# EAGLE design untitled2222 (EAGLE 5.08)
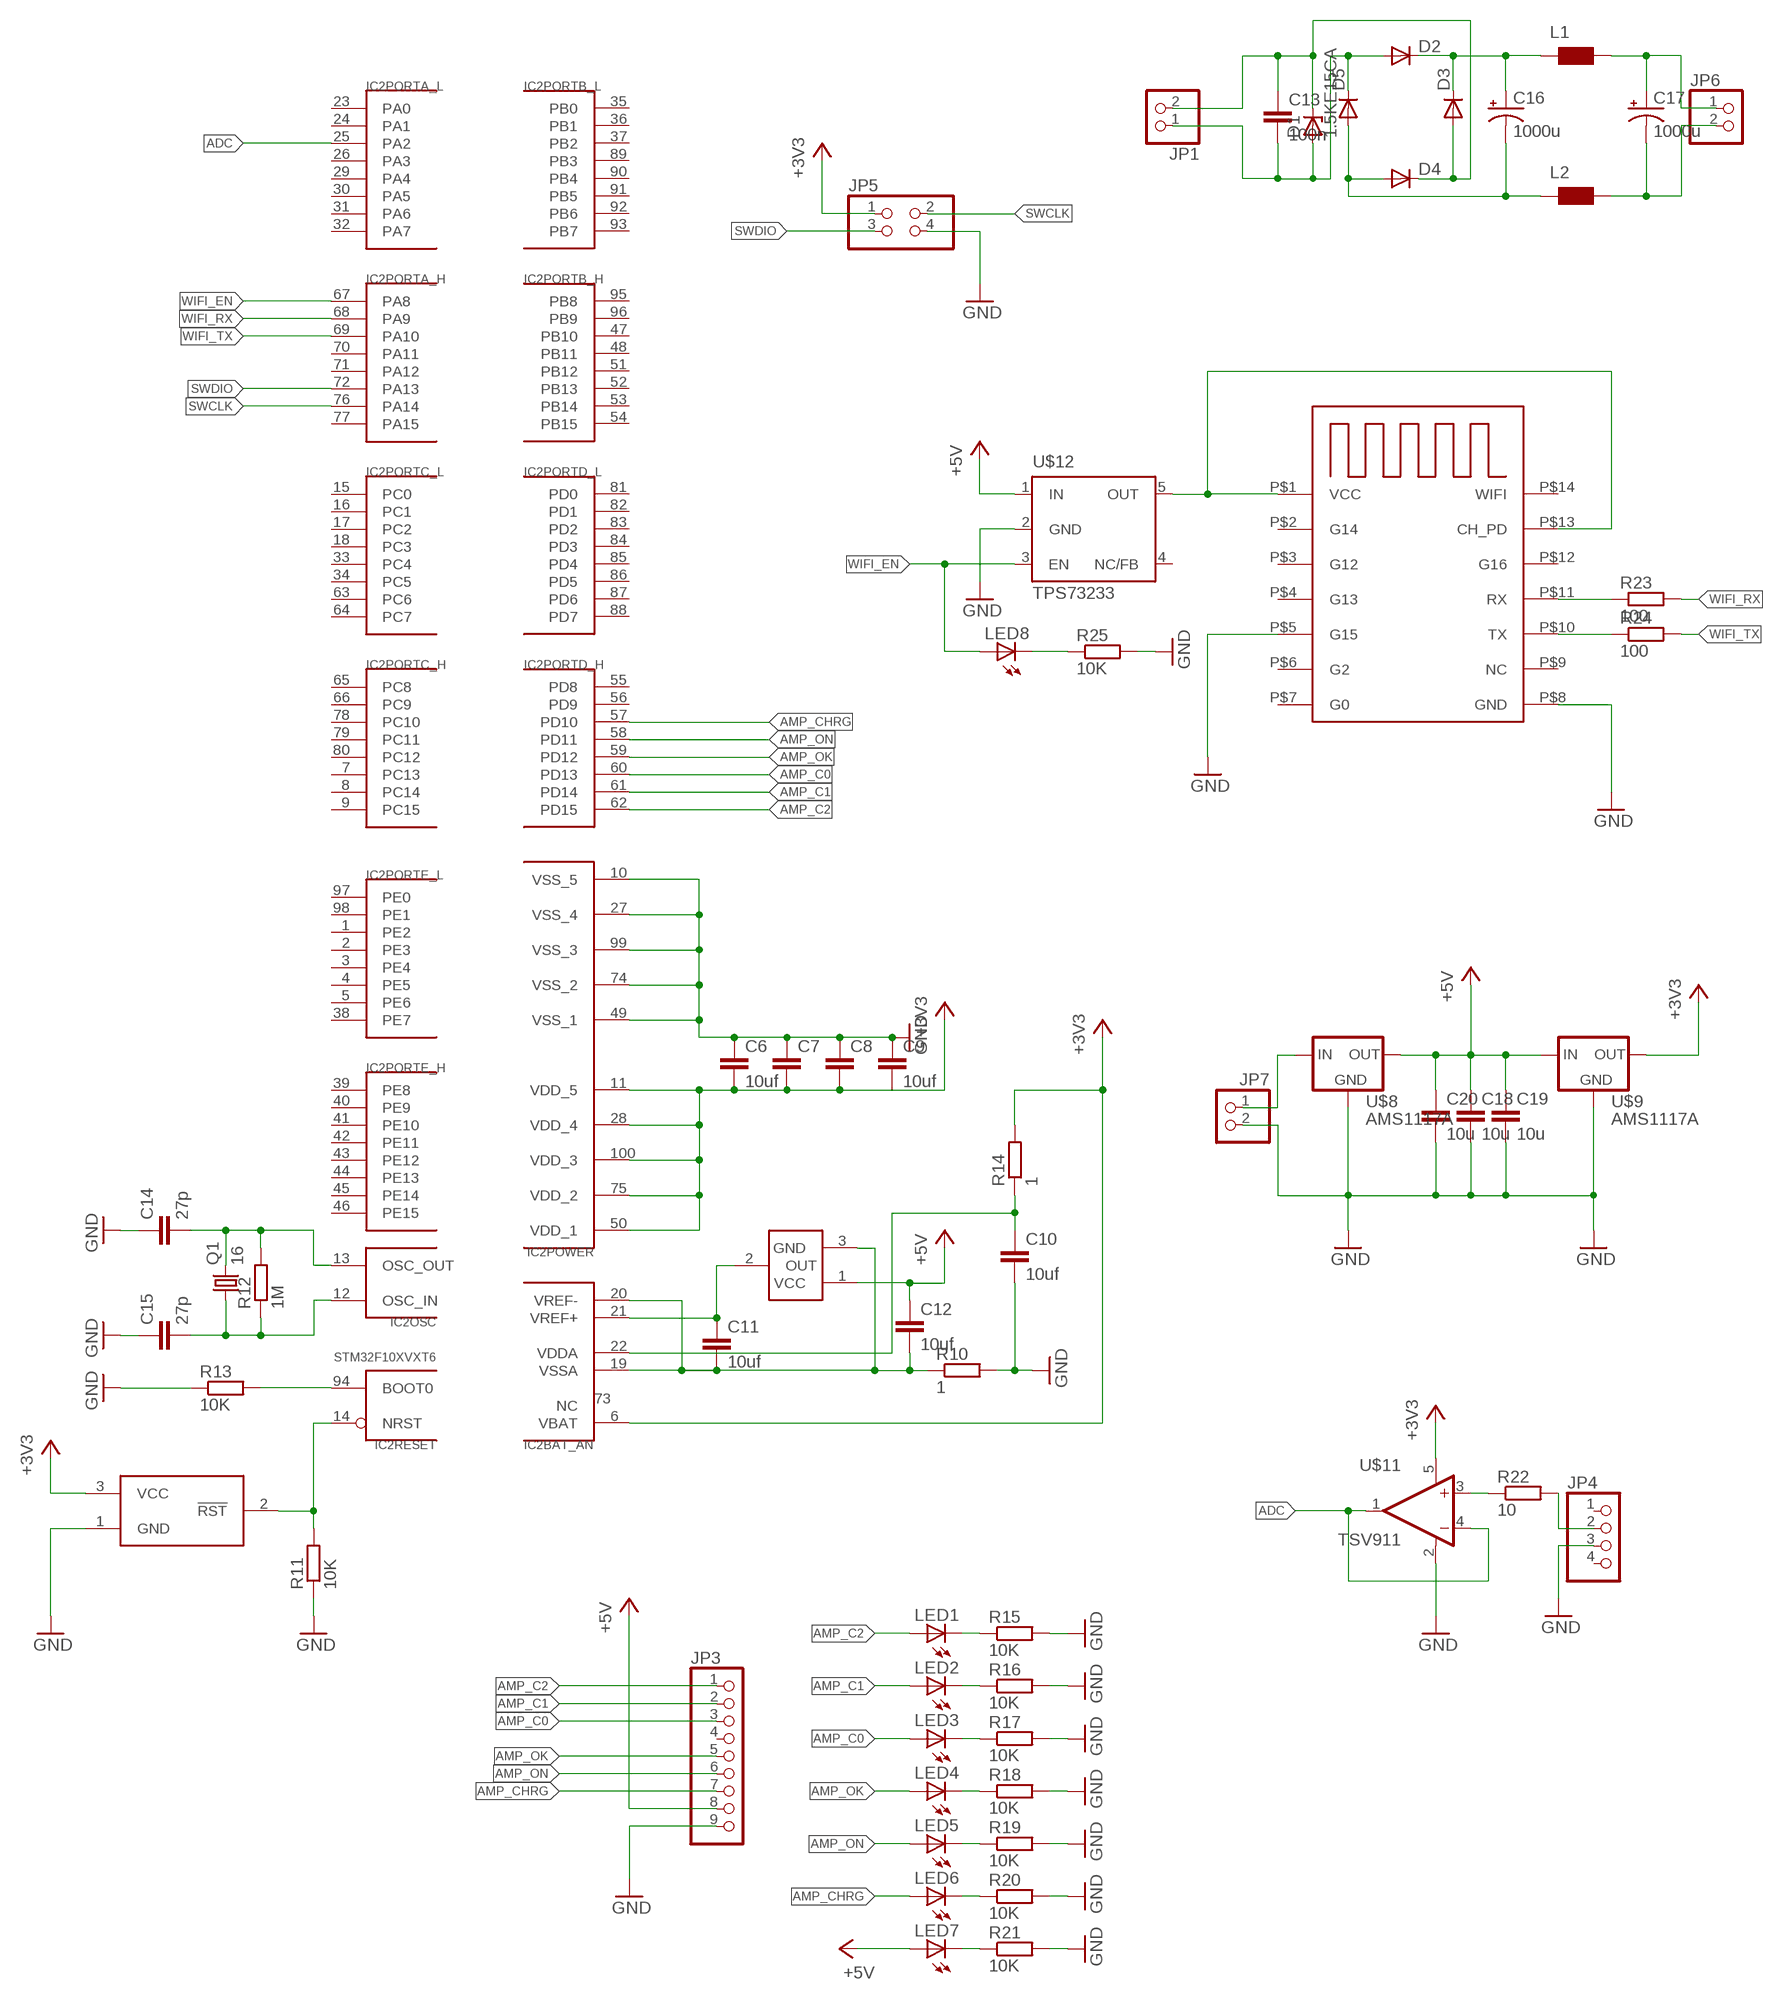
[diagram p0: schematic, sheet 1]

## Parts
C6  10uf  C-EUC0603  [C0603]
C7  C-EUC0603  [C0603]
C8  C-EUC0603  [C0603]
C9  10uf  C-EUC0603  [C0603]
C10  10uf  C-EUC0603  [C0603]
C11  10uf  C-EUC0603  [C0603]
C12  10uf  C-EUC0805  [C0805]
C13  100n  C-EUC0603  [C0603]
C14  27p  C-EUC0603  [C0603]
C15  27p  C-EUC0603  [C0603]
C16  1000u  CPOL-USE5-8.5  [E5-8,5]
C17  1000u  CPOL-USE5-8.5  [E5-8,5]
C18  10u  C-EUC0603  [C0603]
C19  10u  C-EUC0805  [C0805]
C20  10u  C-EUC0805  [C0805]
D1  1.5KE15CA  ZENER-DIODEZD-12.5  [ZDIO12.5]
D2  DIODE-SMB  [SMB]
D3  DIODE-SMB  [SMB]
D4  DIODE-SMB  [SMB]
D5  DIODE-SMB  [SMB]
IC2  STM32F10XVXT6  [TQFP100]
JP1  PINHD-1X2  [1X02]
JP3  PINHD-1X09_2.54-S  [1X09-S]
JP4  PINHD-1X04_2.54-S  [1X04-S]
JP5  PINHD-2X02_2.54-SMD  [2X02SMD]
JP6  PINHD-1X2  [1X02]
JP7  PINHD-1X02_2.54  [1X02]
L1  WE-ASI_L  [WE-ASI_L]
L2  WE-ASI_L  [WE-ASI_L]
LED1  LEDCHIPLED_0805  [CHIPLED_0805]
LED2  LEDCHIPLED_0805  [CHIPLED_0805]
LED3  LEDCHIPLED_0805  [CHIPLED_0805]
LED4  LEDCHIPLED_0805  [CHIPLED_0805]
LED5  LEDCHIPLED_0805  [CHIPLED_0805]
LED6  LEDCHIPLED_0805  [CHIPLED_0805]
LED7  LEDCHIPLED_0805  [CHIPLED_0805]
LED8  LEDCHIPLED_0805  [CHIPLED_0805]
Q1  16  CRYSTALHC49UP  [HC49UP]
R10  1  R-EU_R0603  [R0603]
R11  10K  R-EU_R0603  [R0603]
R12  1M  R-EU_R0603  [R0603]
R13  10K  R-EU_R0603  [R0603]
R14  1  R-EU_R0603  [R0603]
R15  10K  R-EU_R0603  [R0603]
R16  10K  R-EU_R0603  [R0603]
R17  10K  R-EU_R0603  [R0603]
R18  10K  R-EU_R0603  [R0603]
R19  10K  R-EU_R0603  [R0603]
R20  10K  R-EU_R0603  [R0603]
R21  10K  R-EU_R0603  [R0603]
R22  10  R-EU_R0603  [R0603]
R23  100  R-EU_R0603  [R0603]
R24  100  R-EU_R0603  [R0603]
R25  10K  R-EU_R0603  [R0603]
U$6  REF3025  [SOT23]
U$7  ESP03  [ESP03]
U$8  AMS1117A  [DPACK]
U$9  AMS1117A  [DPACK]
U$10  LM809  [SOT23]
U$11  TSV911  [SOT23-5L]
U$12  TPS73233  [SOT23-DBV]

## Nets
+3V3: C6.2 C7.2 C8.2 C9.2 IC2.6(BAT_AN:VBAT) IC2.11(POWER:VDD_5) IC2.28(POWER:VDD_4) IC2.50(POWER:VDD_1) IC2.75(POWER:VDD_2) IC2.100(POWER:VDD_3) JP5.1 R14.2 U$9.2(OUT) U$10.3(VCC) U$11.5(V+)
+5V: C12.1 C18.1 C19.1 C20.1 JP3.8 LED7.A U$6.1(VCC) U$8.2(OUT) U$9.3(IN) U$12.1(IN)
ADC: IC2.25(PORTA_L:PA2) U$11.1(OUT) U$11.4(-IN)
AMP_C0: IC2.60(PORTD_H:PD13) JP3.3 LED3.A
AMP_C1: IC2.61(PORTD_H:PD14) JP3.2 LED2.A
AMP_C2: IC2.62(PORTD_H:PD15) JP3.1 LED1.A
AMP_CHRG: IC2.57(PORTD_H:PD10) JP3.7 LED6.A
AMP_OK: IC2.59(PORTD_H:PD12) JP3.5 LED4.A
AMP_ON: IC2.58(PORTD_H:PD11) JP3.6 LED5.A
GND: C6.1 C7.1 C8.1 C9.1 C10.2 C14.1 C15.1 C18.2 C19.2 C20.2 IC2.10(POWER:VSS_5) IC2.27(POWER:VSS_4) IC2.49(POWER:VSS_1) IC2.74(POWER:VSS_2) IC2.99(POWER:VSS_3) JP3.9 JP4.3 JP5.4 JP7.2 R10.2 R11.1 R13.1 R15.2 R16.2 R17.2 R18.2 R19.2 R20.2 R21.2 R25.2 U$7.P$5(G15) U$7.P$8(GND) U$8.1(GND) U$9.1(GND) U$10.1(GND) U$11.2(V-) U$12.2(GND)
N$12: C13.2 D1.A D2.A D5.C JP1.1
N$13: C17.+ JP6.1 L1.1
N$14: C11.1 IC2.21(BAT_AN:VREF+) U$6.2(OUT)
N$15: C10.1 IC2.22(BAT_AN:VDDA) R14.1
N$16: C11.2 C12.2 IC2.19(BAT_AN:VSSA) IC2.20(BAT_AN:VREF-) R10.1 U$6.3(GND)
N$17: IC2.14(RESET:NRST) R11.2 U$10.2(!RST)
N$18: C16.+ D2.C D3.C L1.2
N$19: C16.- D4.A D5.A L2.2
N$20: C14.2 IC2.13(OSC:OSC_OUT) Q1.2 R12.2
N$21: C15.2 IC2.12(OSC:OSC_IN) Q1.1 R12.1
N$22: IC2.94(RESET:BOOT0) R13.2
N$23: C13.1 D1.C D3.A D4.C JP1.2
N$24: U$7.P$1(VCC) U$7.P$13(CH_PD) U$12.5(OUT)
N$25: LED8.C R25.1
N$28: R22.1 U$11.3(+IN)
N$29: LED7.C R21.1
N$30: JP7.1 U$8.3(IN)
N$32: JP4.2 R22.2
N$35: LED1.C R15.1
N$36: LED2.C R16.1
N$37: LED3.C R17.1
N$38: LED4.C R18.1
N$39: LED5.C R19.1
N$40: LED6.C R20.1
PW_GND: C17.- JP6.2 L2.1
SWCLK: IC2.76(PORTA_H:PA14) JP5.2
SWDIO: IC2.72(PORTA_H:PA13) JP5.3
WIFI_EN: IC2.67(PORTA_H:PA8) LED8.A U$12.3(EN)
WIFI_RX: IC2.68(PORTA_H:PA9) R23.2
WIFI_RX1: R23.1 U$7.P$11(RX)
WIFI_TX: IC2.69(PORTA_H:PA10) R24.2
WIFI_TX1: R24.1 U$7.P$10(TX)
Unconnected: IC2.1(PORTE_L:PE2) IC2.2(PORTE_L:PE3) IC2.3(PORTE_L:PE4) IC2.4(PORTE_L:PE5) IC2.5(PORTE_L:PE6) IC2.7(PORTC_H:PC13) IC2.8(PORTC_H:PC14) IC2.9(PORTC_H:PC15) IC2.15(PORTC_L:PC0) IC2.16(PORTC_L:PC1) IC2.17(PORTC_L:PC2) IC2.18(PORTC_L:PC3) IC2.23(PORTA_L:PA0) IC2.24(PORTA_L:PA1) IC2.26(PORTA_L:PA3) IC2.29(PORTA_L:PA4) IC2.30(PORTA_L:PA5) IC2.31(PORTA_L:PA6) IC2.32(PORTA_L:PA7) IC2.33(PORTC_L:PC4) IC2.34(PORTC_L:PC5) IC2.35(PORTB_L:PB0) IC2.36(PORTB_L:PB1) IC2.37(PORTB_L:PB2) IC2.38(PORTE_L:PE7) IC2.39(PORTE_H:PE8) IC2.40(PORTE_H:PE9) IC2.41(PORTE_H:PE10) IC2.42(PORTE_H:PE11) IC2.43(PORTE_H:PE12) IC2.44(PORTE_H:PE13) IC2.45(PORTE_H:PE14) IC2.46(PORTE_H:PE15) IC2.47(PORTB_H:PB10) IC2.48(PORTB_H:PB11) IC2.51(PORTB_H:PB12) IC2.52(PORTB_H:PB13) IC2.53(PORTB_H:PB14) IC2.54(PORTB_H:PB15) IC2.55(PORTD_H:PD8) IC2.56(PORTD_H:PD9) IC2.63(PORTC_L:PC6) IC2.64(PORTC_L:PC7) IC2.65(PORTC_H:PC8) IC2.66(PORTC_H:PC9) IC2.70(PORTA_H:PA11) IC2.71(PORTA_H:PA12) IC2.73(BAT_AN:NC) IC2.77(PORTA_H:PA15) IC2.78(PORTC_H:PC10) IC2.79(PORTC_H:PC11) IC2.80(PORTC_H:PC12) IC2.81(PORTD_L:PD0) IC2.82(PORTD_L:PD1) IC2.83(PORTD_L:PD2) IC2.84(PORTD_L:PD3) IC2.85(PORTD_L:PD4) IC2.86(PORTD_L:PD5) IC2.87(PORTD_L:PD6) IC2.88(PORTD_L:PD7) IC2.89(PORTB_L:PB3) IC2.90(PORTB_L:PB4) IC2.91(PORTB_L:PB5) IC2.92(PORTB_L:PB6) IC2.93(PORTB_L:PB7) IC2.95(PORTB_H:PB8) IC2.96(PORTB_H:PB9) IC2.97(PORTE_L:PE0) IC2.98(PORTE_L:PE1) JP3.4 JP4.1 JP4.4 U$7.P$2(G14) U$7.P$3(G12) U$7.P$4(G13) U$7.P$6(G2) U$7.P$7(G0) U$7.P$9(NC) U$7.P$12(G16) U$7.P$14(WIFI) U$12.4(NC/FB)

## Library data of the parts
C6-C15 C18-C20 = rcl:C-EU: CAPACITOR, European symbol
C16 C17 = rcl:CPOL-US: POLARIZED CAPACITOR, American symbol
D1 = diode:ZENER-DIODE: Z-Diode
D2-D5 = diode:DIODE-: DIODE
IC2 = stm32:STM32F10XVXT6: STM32F101/103 100 pin LQFP
JP1 JP6 = pinhead:PINHD-1X2: PIN HEADER
JP3 = pinhead-2:PINHD-1X09: PIN HEADER
JP4 = pinhead-2:PINHD-1X04: PIN HEADER
JP5 = pinhead-2:PINHD-2X02: PIN HEADER
JP7 = pinhead-2:PINHD-1X02: PIN HEADER
L1 L2 = wuerth-elektronik:WE-ASI: SMD-Wire Wound Inductor WE-ASI Especially designed for Automation Standard Interface applications - Specially constructed for sensors and actuators
LED1-LED8 = led:LED: LED OSRAM: - CHIPLED LG R971, LG N971, LY N971, LG Q971, LY Q971, LO R971, LY R971 LH N974, LH R974 LS Q976, LO Q976, LY Q976 LO Q996 - Hyper CHIPLED LW Q18S LB Q993, LB Q99A, LB R99A - SideLED LS A670, LO A670, LY A670, LG A670, LP A670 LB A673, LV A673, LT A673, LW A673 LH A674 LY A675 LS A676, LA A676, LO A676, LY A676, LW A676 LS A679, LY A679, LG A679 - Hyper Micro SIDELED® LS Y876, LA Y876, LO Y876, LY Y876 LT Y87S - SmartLED LW L88C, LW L88S LB L89C, LB L89S, LG L890 LS L89K, LO L89K, LY L89K LS L896, LA L896, LO L896, LY L896 - TOPLED LS T670, LO T670, LY T670, LG T670, LP T670 LSG T670, LSP T670, LSY T670, LOP T670, LYG T670 LG T671, LOG T671, LSG T671 LB T673, LV T673, LT T673, LW T673 LH T674 LS T676, LA T676, LO T676, LY T676, LB T676, LH T676, LSB T676, LW T676 LB T67C, LV T67C, LT T67C, LS T67K, LO T67K, LY T67K, LW E67C LS E67B, LA E67B, LO E67B, LY E67B, LB E67C, LV E67C, LT E67C LW T67C LS T679, LY T679, LG T679 LS T770, LO T770, LY T770, LG T770, LP T770 LB T773, LV T773, LT T773, LW T773 LH T774 LS E675, LA E675, LY E675, LS T675 LS T776, LA T776, LO T776, LY T776, LB T776 LHGB T686 LT T68C, LB T68C - Hyper Mini TOPLED® LB M676 - Mini TOPLED Santana® LG M470 LS M47K, LO M47K, LY M47K Source: http://www.osram.convergy.de LUXEON: - LUMILED® LXK2-PW12-R00, LXK2-PW12-S00, LXK2-PW14-U00, LXK2-PW14-V00 LXK2-PM12-R00, LXK2-PM12-S00, LXK2-PM14-U00 LXK2-PE12-Q00, LXK2-PE12-R00, LXK2-PE12-S00, LXK2-PE14-T00, LXK2-PE14-U00 LXK2-PB12-K00, LXK2-PB12-L00, LXK2-PB12-M00, LXK2-PB14-N00, LXK2-PB14-P00, LXK2-PB14-Q00 LXK2-PR12-L00, LXK2-PR12-M00, LXK2-PR14-Q00, LXK2-PR14-R00 LXK2-PD12-Q00, LXK2-PD12-R00, LXK2-PD12-S00 LXK2-PH12-R00, LXK2-PH12-S00 LXK2-PL12-P00, LXK2-PL12-Q00, LXK2-PL12-R00 Source: www.luxeon.com KINGBRIGHT: KA-3528ASYC Source: www.kingbright.com
Q1 = crystal:CRYSTAL: CRYSTAL
R10-R25 = resistor:R-EU_: RESISTOR, European symbol
U$6 = ADC:REF3025
U$7 = connectors:ESP03
U$8 U$9 = stabil:AMS1117A
U$10 = ARM:LM809
U$11 = OU:TSV911
U$12 = stabil:TPS73233

## Board
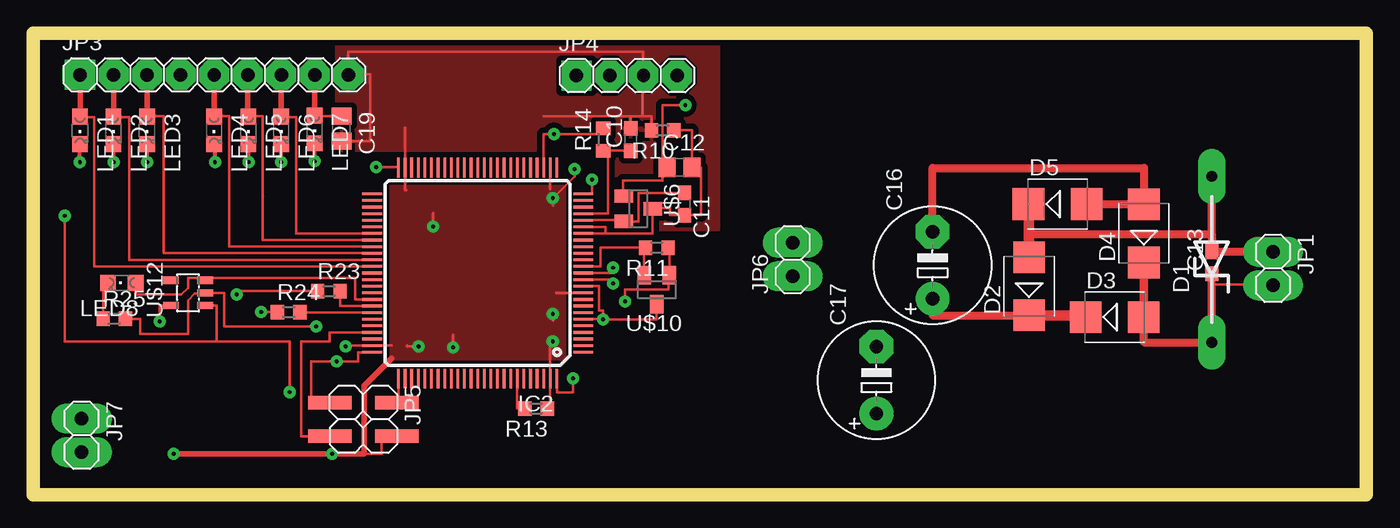
[diagram p1: board, top side]
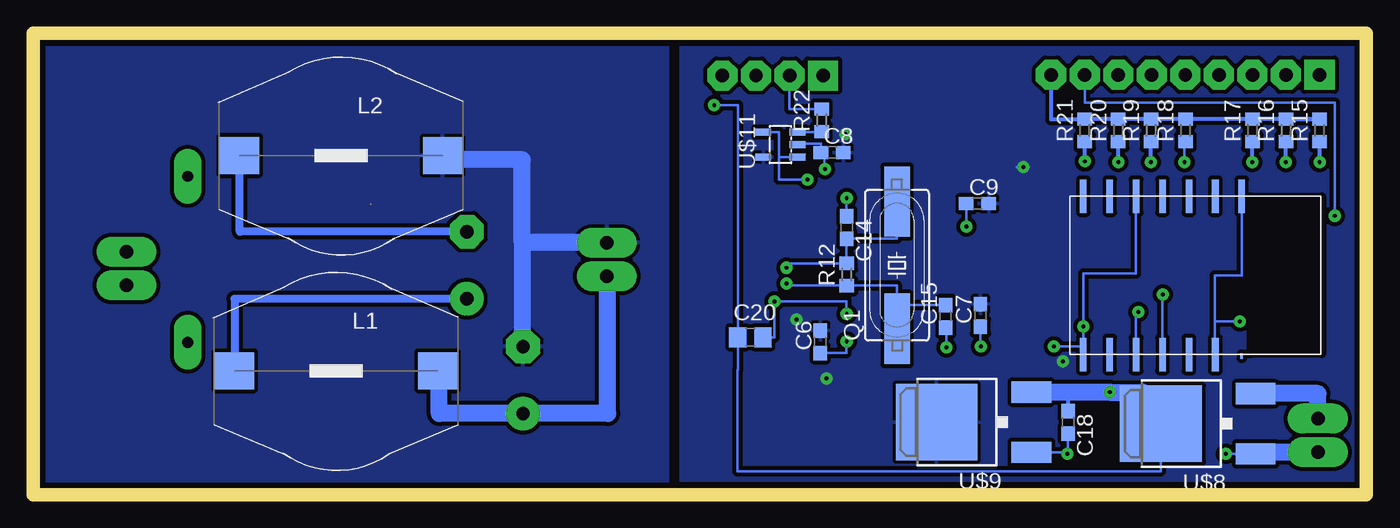
[diagram p2: board, bottom side, seen from below]

Size 101 x 35 mm. Coordinates in mm from the lower left corner, seen from the top.
Outline: 0,0 101,0 101,35 0,35 0,0
Copper layers (1*16): Top 0.015mm / dielectric 1.5mm / Bottom 0.015mm
Design rules "default *": minimum track width 0.2mm, minimum drill 0.3mm, track to track 0.25mm, track to pad 0.25mm, pad to pad 0.25mm, via to via 0.25mm, smd to smd 0.25mm, copper to edge 0.4mm, drill to drill 0.4mm, minimum pad ring 25mil, minimum via ring 12mil, stop-mask expansion 4mil, vias tented up to drill 0mil, thermal gap 10mil
bRestrict: area 3.4,10.7 to 8.8,22.6

### Footprints (pad centres in the part's own frame; a part is rotated, then mirrored left to right if it is on the bottom)
C0603 = smd 1.1 x 1: 1 -0.85,0; 2 0.85,0
C0805 = smd 1.3 x 1.5: 1 -0.95,0; 2 0.95,0
E5-8,5 = drill 1.016 pad 2.54 round: + -2.54,0 | drill 1.016 pad 2.54 octagon: - 2.54,0
ZDIO12.5 = drill 0.813 long: A 6.223,0; C -6.35,0
SMB = smd 2.4 x 2.4: A 2.2,0; C -2.2,0
TQFP100 = smd 1.5 x 0.2: 1 -8,6; 2 -8,5.5; 3 -8,5; 4 -8,4.5; 5 -8,4; 6 -8,3.5; 7 -8,3; 8 -8,2.5; 9 -8,2; 10 -8,1.5; 11 -8,1; 12 -8,0.5; 13 -8,0; 14 -8,-0.5; 15 -8,-1; 16 -8,-1.5; 17 -8,-2; 18 -8,-2.5; 19 -8,-3; 20 -8,-3.5; 21 -8,-4; 22 -8,-4.5; 23 -8,-5; 24 -8,-5.5; 25 -8,-6; 51 8,-6; 52 8,-5.5; 53 8,-5; 54 8,-4.5; 55 8,-4; 56 8,-3.5; 57 8,-3; 58 8,-2.5; 59 8,-2; 60 8,-1.5; 61 8,-1; 62 8,-0.5; 63 8,0; 64 8,0.5; 65 8,1; 66 8,1.5; 67 8,2; 68 8,2.5; 69 8,3; 70 8,3.5; 71 8,4; 72 8,4.5; 73 8,5; 74 8,5.5; 75 8,6 | smd 0.2 x 1.5: 26 -6,-8; 27 -5.5,-8; 28 -5,-8; 29 -4.5,-8; 30 -4,-8; 31 -3.5,-8; 32 -3,-8; 33 -2.5,-8; 34 -2,-8; 35 -1.5,-8; 36 -1,-8; 37 -0.5,-8; 38 0,-8; 39 0.5,-8; 40 1,-8; 41 1.5,-8; 42 2,-8; 43 2.5,-8; 44 3,-8; 45 3.5,-8; 46 4,-8; 47 4.5,-8; 48 5,-8; 49 5.5,-8; 50 6,-8; 76 6,8; 77 5.5,8; 78 5,8; 79 4.5,8; 80 4,8; 81 3.5,8; 82 3,8; 83 2.5,8; 84 2,8; 85 1.5,8; 86 1,8; 87 0.5,8; 88 0,8; 89 -0.5,8; 90 -1,8; 91 -1.5,8; 92 -2,8; 93 -2.5,8; 94 -3,8; 95 -3.5,8; 96 -4,8; 97 -4.5,8; 98 -5,8; 99 -5.5,8; 100 -6,8
1X02 = drill 1.016 long: 1 -1.27,0; 2 1.27,0
1X09-S = drill 1.016 square: 1 -10.16,0 | drill 1.016 octagon: 2 -7.62,0; 3 -5.08,0; 4 -2.54,0; 5 0,0; 6 2.54,0; 7 5.08,0; 8 7.62,0; 9 10.16,0
1X04-S = drill 1.016 square: 1 -3.81,0 | drill 1.016 octagon: 2 -1.27,0; 3 1.27,0; 4 3.81,0
2X02SMD = smd 1.016 x 3.302: 1 -1.27,-3.81; 2 -1.27,1.27; 3 1.27,-3.81; 4 1.27,1.27
WE-ASI_L = smd 2.92 x 2.79: 1 -7.685,0; 2 7.685,0
CHIPLED_0805 = smd 1.2 x 1.2: A 0,-1.05; C 0,1.05
HC49UP = smd 5.334 x 1.93: 1 -4.826,0; 2 4.826,0
R0603 = smd 1 x 1.1: 1 -0.85,0; 2 0.85,0
SOT23 = smd 1 x 1.4: 1 -0.95,-1.1; 2 0.95,-1.1; 3 0,1.1
ESP03 = smd 2.54 x 0.5: P$1 0,0; P$2 0,-2; P$3 0,-4; P$4 0,-6; P$5 0,-8; P$6 0,-10; P$7 0,-12; P$8 12,-12; P$9 12,-10; P$10 12,-8; P$11 12,-6; P$12 12,-4; P$13 12,-2 | smd 0.406 x 0.203: P$14 12.13,0
DPACK = smd 1.6 x 3: 1 -2.28,-4.8; 3 2.28,-4.8 | smd 5.8 x 6.2: 2 0,2.38
SOT23-5L = smd 0.55 x 1.2: 1 -0.95,-1.3; 2 0,-1.3; 3 0.95,-1.3; 4 0.95,1.3; 5 -0.95,1.3
SOT23-DBV = smd 0.55 x 1.2: 1 -0.95,-1.3; 2 0,-1.3; 3 0.95,-1.3; 4 0.95,1.3; 5 -0.95,1.3

### Placement (x,y rotation side)
C6  41.37,11.59 90 bottom
C7  29.24,13.6 90 bottom
C8  40.47,25.94 0 bottom
C9  29.46,22.06 0 bottom
C10  45.28,26.92 90 top
C11  49.34,22.03 270 top
C12  48.97,24.81 0 top
C13  89.28,17.59 90 top
C14  39.37,20.26 270 bottom
C15  31.88,13.53 90 bottom
C16  68.14,17.4 90 top
C17  63.88,8.7 90 top
C18  22.61,5.5 270 bottom
C19  23.37,27.75 270 top
C20  46.67,11.94 0 bottom
D1  89.28,17.91 90 top
D2  75.44,15.81 90 top
D3  81.92,13.46 0 top
D4  84.14,19.81 90 top
D5  77.6,22.03 0 top
IC2  33.68,16.81 180 top
JP1  93.92,17.14 270 top
JP3  13.72,31.84 0 top
JP4  44.97,31.77 0 top
JP5  26.29,5.71 270 top
JP6  57.53,17.84 90 top
JP7  3.68,4.51 270 top
L1  78.04,9.4 180 bottom
L2  77.66,25.72 180 bottom
LED1  3.56,27.62 180 top
LED2  6.1,27.62 180 top
LED3  8.64,27.62 180 top
LED4  13.72,27.62 180 top
LED5  16.32,27.62 180 top
LED6  18.8,27.62 180 top
LED7  21.34,27.69 180 top
LED8  6.73,16.07 90 top
Q1  35.56,17.4 90 bottom
R10  47.69,27.62 180 top
R11  47.24,18.73 180 top
R12  39.37,16.7 90 bottom
R13  38.1,6.54 180 top
R14  43.18,26.92 90 top
R15  3.56,27.62 90 bottom
R16  6.1,27.62 90 bottom
R17  8.64,27.62 90 bottom
R18  13.72,27.62 90 bottom
R19  16.32,27.62 90 bottom
R20  18.8,27.62 90 bottom
R21  21.34,27.62 90 bottom
R22  41.27,28.38 90 bottom
R23  22.42,15.43 0 top
R24  19.37,13.84 0 top
R25  6.16,13.34 0 top
U$6  45.83,21.68 270 top
U$7  9.45,22.64 270 bottom
U$8  13.19,5.39 90 bottom
U$9  30.18,5.5 90 bottom
U$10  47.24,15.56 180 top
U$11  44.39,26.54 90 bottom
U$12  11.75,15.3 90 top

### Tracks (layer width: path | path; a pad name or v marks a point on that pad's centre or on a via)
+3V3  (via drill 0.3)
  Top 0.2: IC2.6 v43.18,13.31 v43.18,13.3 | 39.43,27.34 39.43,27.37 | R14.2 43.18,27.34 v39.47,27.34 39.43,27.34 | U$10.3 47.24,13.3 v43.18,13.3 | IC2.50 27.68,24.83 v25.97,24.83 | IC2.28 38.68,27.34 39.43,27.34 | JP5.1 21.08,6.99 21.08,10.1 v22.99,10.1 24.64,10.1 24.64,10.79 25.68,10.79 IC2.75 | v40.89,8.83 40.89,7.75 39.68,7.75 IC2.100 | IC2.11 42.86,15.81 42.86,13.97 43.18,13.97 v43.18,13.3
  Bottom 0.2: v25.97,24.83 26.48,24.83 | v40.89,8.83 40.58,8.83
  pour Bottom (isolate 0.305): 0.96,34.06 51.96,34.06 51.96,1.06 0.96,1.06
+5V  (via drill 0.3)
  Top 0.2: U$6.1 44.7,22.63 44.7,23.81 47.69,23.81 47.69,24.81 | U$12.1 13.91,14.35 13.91,11.62 | 47.69,24.81 47.69,29.53 v49.4,29.53 | C19.1 21.34,28.7 LED7.A | 47.69,24.81 C12.1 | 13.91,11.62 19.43,11.62 v19.43,7.78 | 13.91,11.62 2.41,11.62 v2.41,21.14
  Top 0.406: JP3.8 LED7.A
  Bottom 0.2: U$9.3 23.11,7.78 | v2.41,21.14 2.41,29.72 21.34,29.72 JP3.8 | 16.97,7.78 15.57,7.78 U$8.2 15.57,1.78 47.64,1.78 47.64,9.46 47.62,9.46 C20.1 47.62,29.53 v49.4,29.53
  Bottom 0.305: 22.61,7.78 C18.1
  Bottom 1.27: 16.97,7.78 v19.43,7.78 22.61,7.78 U$9.3
ADC  (via drill 0.3)  (1 unrouted)
  Top 0.2: v42.35,23.88 42.35,22.8 41.68,22.8 IC2.25
  Bottom 0.2: U$11.4 44.51,27.5 44.51,25.59 | 44.51,25.59 U$11.1 | v42.35,23.88 44.51,23.88 44.51,25.59
AMP_C0
  Top 0.2: IC2.60 9.91,18.31 9.91,28.7 8.64,28.7 LED3.A
  Top 0.406: LED3.A JP3.3
AMP_C1
  Top 0.2: IC2.61 7.3,17.81 7.3,28.64 6.1,28.64 LED2.A
  Top 0.406: JP3.2 LED2.A
AMP_C2
  Top 0.2: IC2.62 4.64,17.31 4.64,28.64 3.56,28.64 LED1.A
  Top 0.406: LED1.A JP3.1
AMP_CHRG
  Top 0.2: IC2.57 19.94,19.81 19.94,28.64 18.8,28.64 LED6.A
  Top 0.406: LED6.A JP3.7
AMP_OK
  Top 0.2: IC2.59 14.86,18.81 14.86,28.7 13.72,28.7 LED4.A
  Top 0.406: LED4.A JP3.5
AMP_ON
  Top 0.2: IC2.58 17.4,19.31 17.4,28.7 16.32,28.7 LED5.A
  Top 0.406: LED5.A 16.26,28.67 JP3.6
GND  (via drill 0.3)  (1 unrouted)
  Top 0.2: v31.81,11.18 31.81,12.13 | v29.21,11.24 28.32,11.24 28.32,11.3 | 39.37,21.91 v39.37,22.48 41.02,24.13 v41.02,24.7 | 46.16,28.7 45.28,28.7 | 46.16,28.7 46.84,28.7 R10.2 | 45.28,28.7 38.68,28.7 | 45.28,28.7 C10.2 | v44.83,14.67 44.83,15.56 48.13,15.56 48.13,16.66 U$10.1 48.19,18.29 48.09,18.29 R11.1 | v39.37,13.72 39.37,13.21 | 46.16,28.7 46.16,31.77 JP4.3 46.22,31.77 46.22,33.58 23.88,33.58 JP3.9 23.88,31.88 25.53,31.88 25.53,26.8 C19.2 | JP5.4 26.42,4.45 26.42,3.11 24.89,3.11 | v21.45,12.76 14.48,12.76 14.48,15.3 U$12.2 12.98,15.24 12.26,15.24 11.75,14.73 11.75,12.19 8.13,12.19 8.13,13.34 R25.2 | IC2.99 39.18,6.77 R13.1 38.95,6.82 39.18,7.05 39.18,11.62 v39.37,11.62 | IC2.10 39.62,15.3 | IC2.74 | v30.29,20.32 30.29,21.34 | 28.26,23.11 28.18,23.11 IC2.49 28.18,27.8 28.19,27.81 | IC2.27 39.18,23.18 | IC2.74 23.69,11.31 v23.69,11.24 | IC2.74 27.18,11.31 27.18,11.3
  Top 0.406: v10.67,3.11 v22.67,3.11 24.89,3.11 25.08,3.11 25.08,8.26 27.18,10.35
  Bottom 0.2: C15.1 31.81,12.68 v31.81,11.18 | 29.21,11.27 v29.21,11.24 29.24,11.24 C7.1 | C14.1 v39.37,22.48 | v39.37,13.72 39.37,14.67 v44.83,14.67 44.83,11.94 C20.2 | 17.46,22.64 17.46,16.76 21.45,16.76 v21.45,12.76 U$7.P$8 21.45,11.24 v23.69,11.24 | C9.1 30.31,20.32 v30.29,20.32 | v41.02,24.7 41.05,24.7 41.05,25.91 41.29,25.91 C8.1 41.34,25.94 41.34,26.61 43.09,26.61 U$11.2 | C6.1 39.37,10.74 v39.37,11.62 | U$9.1 22.67,3.22 v22.67,3.11 22.61,3.11 C18.2 | 8.39,3.24 U$8.1 v10.67,3.11
  Bottom 0.305: JP3.9 23.88,28.45 21.34,28.45 R21.2 R20.2 R19.2 R18.2 R17.2 R16.2 | R15.2 R16.2 | R16.2 3.43,28.47 3.43,28.57
  Bottom 1.27: JP7.2 8.39,3.24
  pour Top: 40.24,10.3 27.16,10.3 27.16,23.38 40.24,23.38
  pour Top (isolate 0.406): 22.96,34.06 22.96,26.1 43.56,26.1 43.56,20.06 51.96,20.06 51.96,34.06
N$12  (1 unrouted)
  Top 0.2: 93.92,18.44 JP1.1
  Top 0.61: 93.92,18.44 C13.2 89.28,19.75 | 89.28,19.75 D1.A | D2.A 75.44,19.75 89.28,19.75
  Top 0.813: D2.A 75.44,22.04
N$13
  Bottom 0.2: 57.59,16.57 JP6.1
  Bottom 1.27: 57.59,16.57 57.47,16.57 57.47,6.16 C17.+ 70.23,6.16 70.23,9.4 L1.1
N$14
  Top 0.2: IC2.21 44.73,20.81 U$6.2 44.73,20.7 45.85,20.7 45.85,22.88 C11.1
N$15
  Top 0.2: 43.56,26.07 C10.1 | 43.56,26.07 R14.1 | IC2.22 43.56,21.31 43.56,26.07
N$16
  Top 0.2: IC2.19 43.37,19.81 | IC2.20 43.37,20.31 43.37,19.81 | 43.37,19.81 46.93,19.81 U$6.3 46.93,21.72 48.26,21.72 48.26,21.18 C11.2 49.34,21.21 50.61,21.21 50.61,24.81 C12.2 49.92,27.62 R10.1
N$17
  Top 0.2: U$10.2 46.29,18.29 46.39,18.29 R11.2 42.99,18.73 42.99,17.31 IC2.14
N$18
  Top 0.61: C16.+ 68.14,13.61 D2.C
  Top 0.813: D3.C 79.72,13.61 D2.C
  Bottom 0.61: L1.2 85.73,14.86 C16.+
N$19
  Top 0.61: D5.A 79.8,22.01 D4.A 84.14,24.77 68.14,24.77 C16.-
  Bottom 0.61: L2.2 85.35,19.94 C16.-
N$20  (via drill 0.3)
  Top 0.2: v43.94,17.21 43.94,16.81 IC2.13
  Bottom 0.2: v43.94,17.21 43.94,17.53 39.37,17.53 R12.2 C14.2 35.56,19.41 Q1.2
N$21  (via drill 0.3)
  Top 0.2: v43.94,16 43.94,16.31 IC2.12
  Bottom 0.2: v43.94,16 43.94,15.85 R12.1 35.56,15.85 35.56,14.39 | 35.56,14.39 Q1.1 | 35.56,14.39 C15.2
N$22
  Top 0.2: R13.2 36.68,6.54 IC2.94
N$23
  Top 0.2: JP1.2 93.92,15.94 89.28,15.94 C13.1
  Top 0.61: 84.14,13.46 D4.C 84.14,11.56 D1.C C13.1
  Top 0.813: 84.14,13.46 D3.A
N$24  (via drill 0.3)
  Top 0.2: U$12.5 9.59,14.35 v9.59,13.14
  Bottom 0.2: U$7.P$1 9.46,22.64 9.46,16.64 11.49,16.64 11.49,13.14 | 11.49,13.14 11.49,10.64 U$7.P$13 | 11.49,13.14 v9.59,13.14
N$25
  Top 0.2: R25.1 5.31,16.07 LED8.C
N$28
  Bottom 0.2: R22.1 41.27,27.49 U$11.3
N$29  (via drill 0.3)
  Top 0.305: v21.34,25.27 LED7.C
  Bottom 0.305: v21.34,25.27 R21.1
N$30
  Bottom 1.27: U$8.3 3.68,7.67 JP7.1
N$32
  Bottom 0.2: 43.79,31.77 JP4.2 43.7,29.23 R22.2
N$35  (via drill 0.3)
  Top 0.305: LED1.C R15.1 v3.56,25.21
  Top 0.406: LED1.C 3.49,26.57
  Bottom 0.305: v3.56,25.21 R15.1
N$36  (via drill 0.3)
  Top 0.305: v6.1,25.21 LED2.C
  Bottom 0.305: v6.1,25.21 R16.1
N$37  (via drill 0.3)
  Top 0.305: v8.64,25.21 LED3.C
  Bottom 0.305: v8.64,25.21 R17.1
N$38  (via drill 0.3)
  Top 0.305: LED4.C 13.78,26.57 v13.78,25.21
  Bottom 0.2: R18.1 13.78,26.77 v13.78,25.21
N$39  (via drill 0.3)
  Top 0.305: v16.32,25.21 LED5.C
  Bottom 0.305: v16.32,25.21 R19.1
N$40  (via drill 0.3)
  Top 0.305: v18.8,25.21 LED6.C
  Bottom 0.305: v18.8,25.21 R20.1
PW_GND
  Bottom 0.61: 69.97,25.4 L2.1
  Bottom 1.27: JP6.2 63.94,19.11 | 69.97,25.4 63.94,25.4 63.94,19.11 | C17.- 63.94,11.24 63.94,19.11
  pour Bottom (isolate 0.305): 100,33.98 100,0.98 52.95,1.04 52.95,34.04
SWCLK
  Top 0.2: IC2.76 27.69,6.99 JP5.2
SWDIO
  Top 0.2: JP5.3 20.32,4.45 20.32,11.62 22.48,11.62 22.48,12.32 IC2.72
WIFI_EN
  Top 0.2: IC2.67 24.38,14.81 24.38,16.45 13.05,16.45 | 13.05,16.45 U$12.3 | 13.05,16.45 11.75,16.45 11.75,15.68 11.24,15.18 7.78,15.18 LED8.A
WIFI_RX
  Top 0.2: IC2.68 23.27,14.31 R23.2
WIFI_RX1  (via drill 0.3)
  Top 0.2: v15.43,15.18 15.43,15.43 R23.1
  Bottom 0.2: U$7.P$11 15.45,15.18 v15.43,15.18
WIFI_TX
  Top 0.2: IC2.69 20.22,13.81 R24.2
WIFI_TX1  (via drill 0.3)
  Top 0.2: v17.27,13.84 R24.1
  Bottom 0.2: v17.27,13.84 17.45,13.84 U$7.P$10